# EAGLE schematic control_unit (EAGLE 5.11)

## Sheet 1 of 4
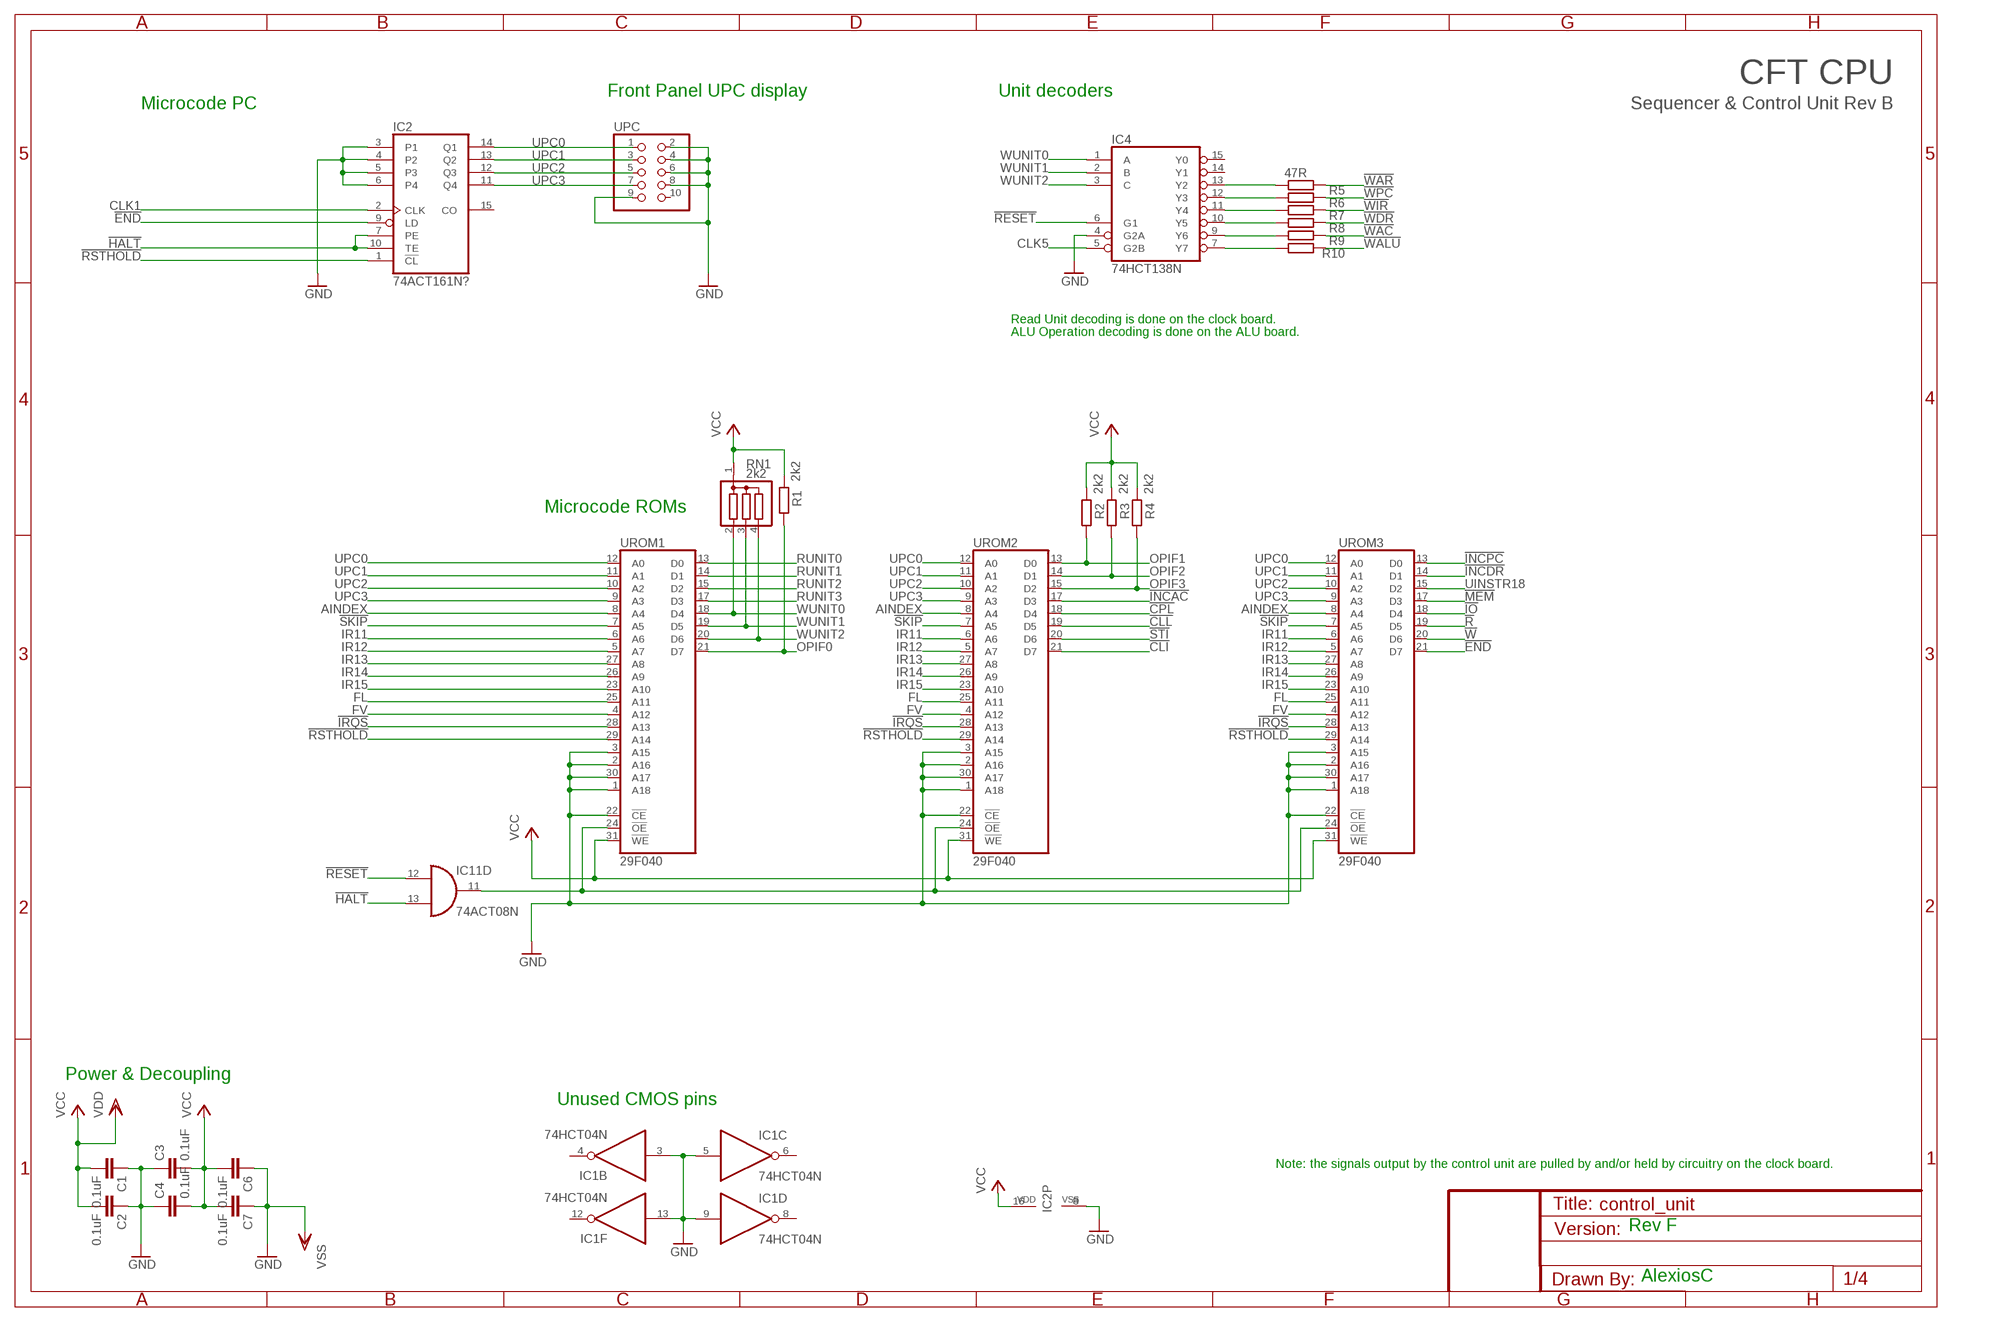
[diagram p0: schematic, sheet 1]

### Parts
C1  0.1uF  C-EU025-025X050  [C025-025X050]
C2  0.1uF  C-EU025-025X050  [C025-025X050]
C3  0.1uF  C-EU025-025X050  [C025-025X050]
C4  0.1uF  C-EU025-025X050  [C025-025X050]
C6  0.1uF  C-EU025-025X050  [C025-025X050]
C7  0.1uF  C-EU025-025X050  [C025-025X050]
IC1  74HCT04N  [DIL14]
IC2  74ACT161N?  4161P  [DIL16]
IC4  74HCT138N  [DIL16]
IC11  74ACT08N  [DIL14]
R1  2k2  R-EU_0207/7  [0207/7]
R2  2k2  R-EU_0207/7  [0207/7]
R3  2k2  R-EU_0207/7  [0207/7]
R4  2k2  R-EU_0207/7  [0207/7]
R5  47R  R-EU_0207/2V  [0207/2V]
R6  47R  R-EU_0207/2V  [0207/2V]
R7  47R  R-EU_0207/2V  [0207/2V]
R8  47R  R-EU_0207/2V  [0207/2V]
R9  47R  R-EU_0207/2V  [0207/2V]
R10  47R  R-EU_0207/2V  [0207/2V]
RN1  2k2  G03R  [SIL4]
UPC  PINHD-2X5/90  [2X05/90]
UROM1  29F040  29F040DIP32  [DIL32]
UROM2  29F040  29F040DIP32  [DIL32]
UROM3  29F040  29F040DIP32  [DIL32]

### Nets
!CLI: UROM2.21(D7) ; also sheet 3
!CLL: UROM2.19(D5) ; also sheet 3
!CPL: UROM2.18(D4) ; also sheet 3
!END: IC2.9(LD) UROM3.21(D7) ; also sheet 3
!HALT: IC2.7(PE) IC2.10(TE) IC11.13(D:I1) ; also sheet 3
!INCAC: UROM2.17(D3) ; also sheet 3
!INCDR: UROM3.14(D1) ; also sheet 3
!INCPC: UROM3.13(D0) ; also sheet 3
!IO: UROM3.18(D4) ; also sheet 3
!IRQS: UROM1.28(A13) UROM2.28(A13) UROM3.28(A13) ; also sheet 3,4
!MEM: UROM3.17(D3) ; also sheet 3
!R: UROM3.19(D5) ; also sheet 3
!RESET: IC4.6(G1) IC11.12(D:I0) ; also sheet 2,3
!RSTHOLD: IC2.1(!CL) UROM1.29(A14) UROM2.29(A14) UROM3.29(A14) ; also sheet 2,3,4
!SKIP: UROM1.7(A5) UROM2.7(A5) UROM3.7(A5) ; also sheet 2,3,4
!STI: UROM2.20(D6) ; also sheet 3
!W: UROM3.20(D6) ; also sheet 3
!WAC: R9.2 ; also sheet 3
!WALU: R10.2 ; also sheet 3
!WAR: R5.2 ; also sheet 3
!WDR: R8.2 ; also sheet 3
!WIR: R7.2 ; also sheet 2,3
!WPC: R6.2 ; also sheet 3
AINDEX: UROM1.8(A4) UROM2.8(A4) UROM3.8(A4) ; also sheet 3,4
CLK1: IC2.2(CLK) ; also sheet 2,3
CLK5: IC4.5(G2B) ; also sheet 3
FL: UROM1.25(A11) UROM2.25(A11) UROM3.25(A11) ; also sheet 2,3,4
FV: UROM1.4(A12) UROM2.4(A12) UROM3.4(A12) ; also sheet 2,3,4
GND [Power]: C1.1 C2.1 C3.1 C4.1 C6.1 C7.1 IC1.3(B:I) IC1.5(C:I) IC1.9(D:I) IC1.13(F:I) IC2.3(P1) IC2.4(P2) IC2.5(P3) IC2.6(P4) IC2.8(VSS) IC4.4(G2A) UPC.2 UPC.4 UPC.6 UPC.8 UPC.9 UROM1.1(A18) UROM1.2(A16) UROM1.3(A15) UROM1.22(!CE) UROM1.30(A17) UROM2.1(A18) UROM2.2(A16) UROM2.3(A15) UROM2.22(!CE) UROM2.30(A17) UROM3.1(A18) UROM3.2(A16) UROM3.3(A15) UROM3.22(!CE) UROM3.30(A17) ; supply symbol labelled VSS ; also sheet 2,3,4
IR11: UROM1.6(A6) UROM2.6(A6) UROM3.6(A6) ; also sheet 2,4
IR12: UROM1.5(A7) UROM2.5(A7) UROM3.5(A7) ; also sheet 2,4
IR13: UROM1.27(A8) UROM2.27(A8) UROM3.27(A8) ; also sheet 2,4
IR14: UROM1.26(A9) UROM2.26(A9) UROM3.26(A9) ; also sheet 2,4
IR15: UROM1.23(A10) UROM2.23(A10) UROM3.23(A10) ; also sheet 2,4
N$1: IC11.11(D:O) UROM1.24(!OE) UROM2.24(!OE) UROM3.24(!OE)
N$7: IC4.13(Y2) R5.1
N$8: IC4.12(Y3) R6.1
N$9: IC4.11(Y4) R7.1
N$10: IC4.10(Y5) R8.1
N$11: IC4.9(Y6) R9.1
N$12: IC4.7(Y7) R10.1
OPIF0: R1.1 UROM1.21(D7) ; also sheet 2
OPIF1: R2.1 UROM2.13(D0) ; also sheet 2
OPIF2: R3.1 UROM2.14(D1) ; also sheet 2
OPIF3: R4.1 UROM2.15(D2) ; also sheet 2
RUNIT0: UROM1.13(D0) ; also sheet 3
RUNIT1: UROM1.14(D1) ; also sheet 3
RUNIT2: UROM1.15(D2) ; also sheet 3
RUNIT3: UROM1.17(D3) ; also sheet 3
UINSTR18: UROM3.15(D2) ; also sheet 3
UPC0: IC2.14(Q1) UPC.1 UROM1.12(A0) UROM2.12(A0) UROM3.12(A0) ; also sheet 4
UPC1: IC2.13(Q2) UPC.3 UROM1.11(A1) UROM2.11(A1) UROM3.11(A1) ; also sheet 4
UPC2: IC2.12(Q3) UPC.5 UROM1.10(A2) UROM2.10(A2) UROM3.10(A2) ; also sheet 4
UPC3: IC2.11(Q4) UPC.7 UROM1.9(A3) UROM2.9(A3) UROM3.9(A3) ; also sheet 4
VCC [Power]: C1.2 C2.2 C3.2 C4.2 C6.2 C7.2 IC2.16(VDD) R1.2 R2.2 R3.2 R4.2 RN1.1 UROM1.31(!WE) UROM2.31(!WE) UROM3.31(!WE) ; supply symbol labelled VDD ; also sheet 2,3,4
WUNIT0: IC4.1(A) RN1.2 UROM1.18(D4)
WUNIT1: IC4.2(B) RN1.3 UROM1.19(D5)
WUNIT2: IC4.3(C) RN1.4 UROM1.20(D6)
Unconnected: IC1.1(A:I) IC1.2(A:O) IC1.4(B:O) IC1.6(C:O) IC1.8(D:O) IC1.12(F:O) IC2.15(CO) IC4.14(Y1) IC4.15(Y0) UPC.10

### Notes on the sheet
- CFT CPU
- Front Panel UPC display | Unit decoders
- Microcode PC | Sequencer & Control Unit Rev B
- Read Unit decoding is done on the clock board.
- ALU Operation decoding is done on the ALU board.
- Microcode ROMs
- Power & Decoupling
- Unused CMOS pins
- Note: the signals output by the control unit are pulled by and/or held by circuitry on the clock board.
- Rev F
- AlexiosC

## Sheet 2 of 4
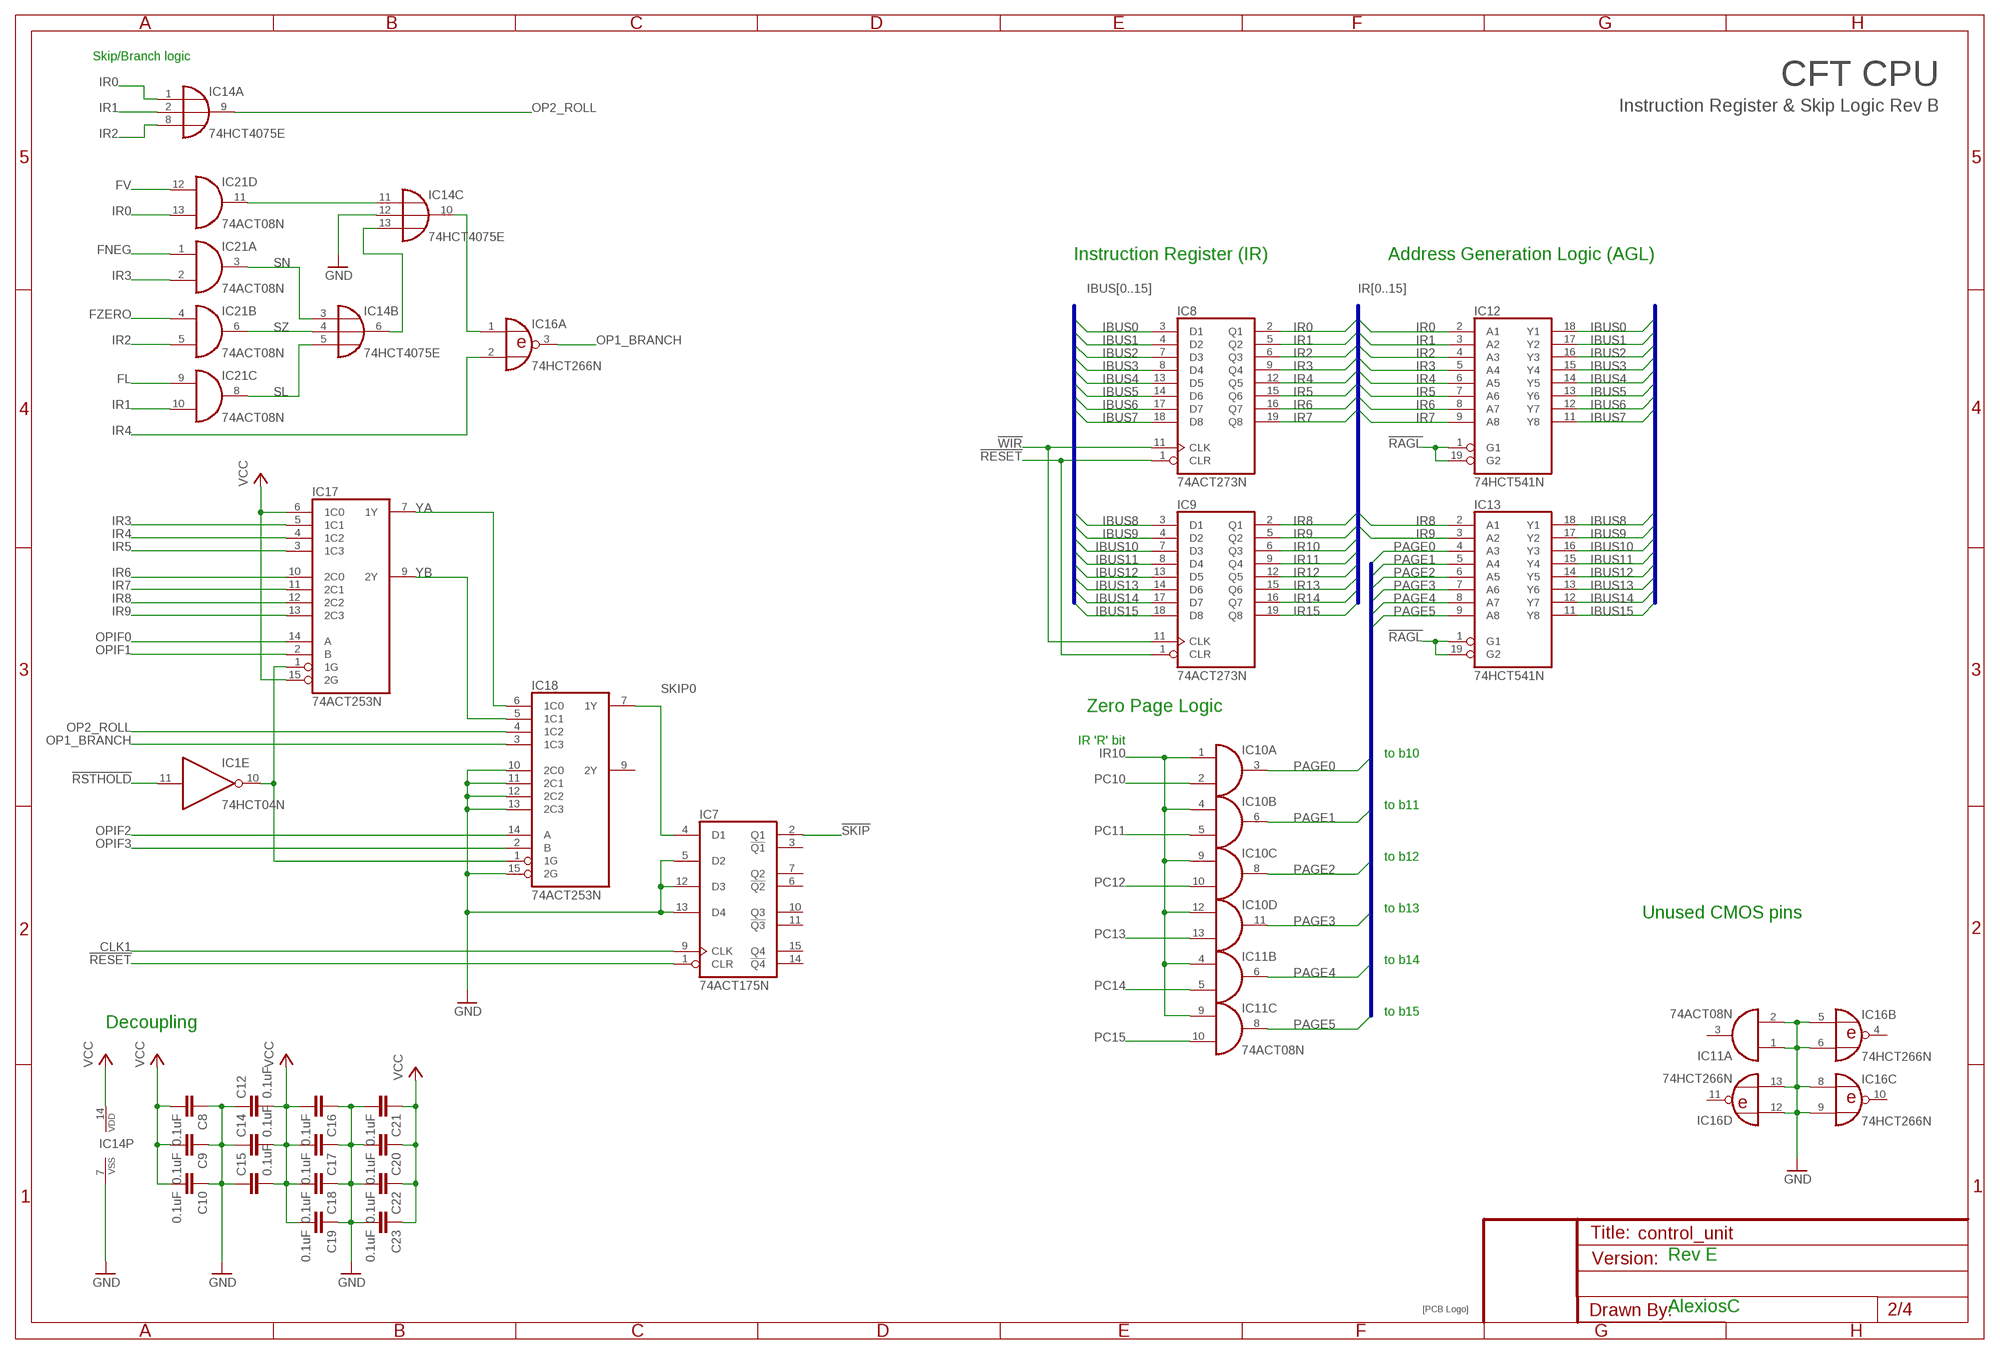
[diagram p1: schematic, sheet 2]

### Parts
C8  0.1uF  C-EU025-025X050  [C025-025X050]
C9  0.1uF  C-EU025-025X050  [C025-025X050]
C10  0.1uF  C-EU025-025X050  [C025-025X050]
C12  0.1uF  C-EU025-025X050  [C025-025X050]
C14  0.1uF  C-EU025-025X050  [C025-025X050]
C15  0.1uF  C-EU025-025X050  [C025-025X050]
C16  0.1uF  C-EU025-025X050  [C025-025X050]
C17  0.1uF  C-EU025-025X050  [C025-025X050]
C18  0.1uF  C-EU025-025X050  [C025-025X050]
C19  0.1uF  C-EU025-025X050  [C025-025X050]
C20  0.1uF  C-EU025-025X050  [C025-025X050]
C21  0.1uF  C-EU025-025X050  [C025-025X050]
C22  0.1uF  C-EU025-025X050  [C025-025X050]
C23  0.1uF  C-EU025-025X050  [C025-025X050]
IC7  74ACT175N  [DIL16]
IC8  74ACT273N  [DIL20]
IC9  74ACT273N  [DIL20]
IC10  74ACT08N  [DIL14]
IC12  74HCT541N  [DIL20]
IC13  74HCT541N  [DIL20]
IC14  74HCT4075E  4075N  [DIL14]
IC16  74HCT266N  74HC266N  [DIL14]
IC17  74ACT253N  [DIL16]
IC18  74ACT253N  [DIL16]
IC21  74ACT08N  [DIL14]
U$3  SIGNATURESILK  [SIGNATURE]

### Nets
!RAGL: IC12.1(G1) IC12.19(G2) IC13.1(G1) IC13.19(G2) ; also sheet 3
!RESET: IC7.1(CLR) IC8.1(CLR) IC9.1(CLR) ; also sheet 1,3
!RSTHOLD: IC1.11(E:I) ; also sheet 1,3,4
!SKIP: IC7.2(Q1) ; also sheet 1,3,4
!WIR: IC8.11(CLK) IC9.11(CLK) ; also sheet 1,3
CLK1: IC7.9(CLK) ; also sheet 1,3
FL: IC21.9(C:I0) ; also sheet 1,3,4
FNEG: IC21.1(A:I0) ; also sheet 3
FV: IC21.12(D:I0) ; also sheet 1,3,4
FZERO: IC21.4(B:I0) ; also sheet 3
GND [Power]: C8.1 C9.1 C10.1 C12.1 C14.1 C15.1 C16.1 C17.1 C18.1 C19.1 C20.2 C21.2 C22.2 C23.2 IC7.5(D2) IC7.12(D3) IC7.13(D4) IC11.1(A:I0) IC11.2(A:I1) IC14.7(P:VSS) IC14.12(C:I1) IC16.5(B:I0) IC16.6(B:I1) IC16.8(C:I0) IC16.9(C:I1) IC16.12(D:I0) IC16.13(D:I1) IC18.10(2C0) IC18.11(2C1) IC18.12(2C2) IC18.13(2C3) IC18.15(2G) ; also sheet 1,3,4
IBUS0: IC8.3(D1) IC12.18(Y1) ; also sheet 3
IBUS1: IC8.4(D2) IC12.17(Y2) ; also sheet 3
IBUS2: IC8.7(D3) IC12.16(Y3) ; also sheet 3
IBUS3: IC8.8(D4) IC12.15(Y4) ; also sheet 3
IBUS4: IC8.13(D5) IC12.14(Y5) ; also sheet 3
IBUS5: IC8.14(D6) IC12.13(Y6) ; also sheet 3
IBUS6: IC8.17(D7) IC12.12(Y7) ; also sheet 3
IBUS7: IC8.18(D8) IC12.11(Y8) ; also sheet 3
IBUS8: IC9.3(D1) IC13.18(Y1) ; also sheet 3
IBUS9: IC9.4(D2) IC13.17(Y2) ; also sheet 3
IBUS10: IC9.7(D3) IC13.16(Y3) ; also sheet 3
IBUS11: IC9.8(D4) IC13.15(Y4) ; also sheet 3
IBUS12: IC9.13(D5) IC13.14(Y5) ; also sheet 3
IBUS13: IC9.14(D6) IC13.13(Y6) ; also sheet 3
IBUS14: IC9.17(D7) IC13.12(Y7) ; also sheet 3
IBUS15: IC9.18(D8) IC13.11(Y8) ; also sheet 3
IR0: IC8.2(Q1) IC12.2(A1) IC14.1(A:I0) IC21.13(D:I1) ; also sheet 3
IR1: IC8.5(Q2) IC12.3(A2) IC14.2(A:I1) IC21.10(C:I1) ; also sheet 3
IR2: IC8.6(Q3) IC12.4(A3) IC14.8(A:I2) IC21.5(B:I1) ; also sheet 3
IR3: IC8.9(Q4) IC12.5(A4) IC17.5(1C1) IC21.2(A:I1)
IR4: IC8.12(Q5) IC12.6(A5) IC16.2(A:I1) IC17.4(1C2)
IR5: IC8.15(Q6) IC12.7(A6) IC17.3(1C3)
IR6: IC8.16(Q7) IC12.8(A7) IC17.10(2C0)
IR7: IC8.19(Q8) IC12.9(A8) IC17.11(2C1)
IR8: IC9.2(Q1) IC13.2(A1) IC17.12(2C2)
IR9: IC9.5(Q2) IC13.3(A2) IC17.13(2C3)
IR10: IC9.6(Q3) IC10.1(A:I0) IC10.4(B:I0) IC10.9(C:I0) IC10.12(D:I0) IC11.4(B:I0) IC11.9(C:I0)
IR11: IC9.9(Q4) ; also sheet 1,4
IR12: IC9.12(Q5) ; also sheet 1,4
IR13: IC9.15(Q6) ; also sheet 1,4
IR14: IC9.16(Q7) ; also sheet 1,4
IR15: IC9.19(Q8) ; also sheet 1,4
N$2: IC14.10(C:O) IC16.1(A:I0)
N$13: IC14.6(B:O) IC14.13(C:I2)
N$14: IC14.11(C:I0) IC21.11(D:O)
OP1_BRANCH: IC16.3(A:O) IC18.3(1C3)
OP2_ROLL: IC14.9(A:O) IC18.4(1C2)
OPIF0: IC17.14(A) ; also sheet 1
OPIF1: IC17.2(B) ; also sheet 1
OPIF2: IC18.14(A) ; also sheet 1
OPIF3: IC18.2(B) ; also sheet 1
PAGE0: IC10.3(A:O) IC13.4(A3)
PAGE1: IC10.6(B:O) IC13.5(A4)
PAGE2: IC10.8(C:O) IC13.6(A5)
PAGE3: IC10.11(D:O) IC13.7(A6)
PAGE4: IC11.6(B:O) IC13.8(A7)
PAGE5: IC11.8(C:O) IC13.9(A8)
PC10: IC10.2(A:I1) ; also sheet 3
PC11: IC10.5(B:I1) ; also sheet 3
PC12: IC10.10(C:I1) ; also sheet 3
PC13: IC10.13(D:I1) ; also sheet 3
PC14: IC11.5(B:I1) ; also sheet 3
PC15: IC11.10(C:I1) ; also sheet 3
RSTHOLD: IC1.10(E:O) IC17.1(1G) IC18.1(1G)
SKIP0: IC7.4(D1) IC18.7(1Y)
SL: IC14.5(B:I2) IC21.8(C:O)
SN: IC14.3(B:I0) IC21.3(A:O)
SZ: IC14.4(B:I1) IC21.6(B:O)
VCC [Power]: C8.2 C9.2 C10.2 C12.2 C14.2 C15.2 C16.2 C17.2 C18.2 C19.2 C20.1 C21.1 C22.1 C23.1 IC14.14(P:VDD) IC17.6(1C0) IC17.15(2G) ; also sheet 1,3,4
YA: IC17.7(1Y) IC18.6(1C0)
YB: IC17.9(2Y) IC18.5(1C1)
Unconnected: IC7.3(!Q1) IC7.6(!Q2) IC7.7(Q2) IC7.10(Q3) IC7.11(!Q3) IC7.14(!Q4) IC7.15(Q4) IC11.3(A:O) IC16.4(B:O) IC16.10(C:O) IC16.11(D:O) IC18.9(2Y)

### Buses
IBUS[0..15]
IR[0..15]
PAGE[0..5]

### Notes on the sheet
- Skip/Branch logic
- CFT CPU
- Instruction Register & Skip Logic Rev B
- Instruction Register (IR) | Address Generation Logic (AGL)
- Zero Page Logic
- IR 'R' bit
- to b10
- to b11
- to b12
- to b13
- Unused CMOS pins
- to b14
- to b15
- Decoupling
- Rev E
- AlexiosC

## Sheet 3 of 4
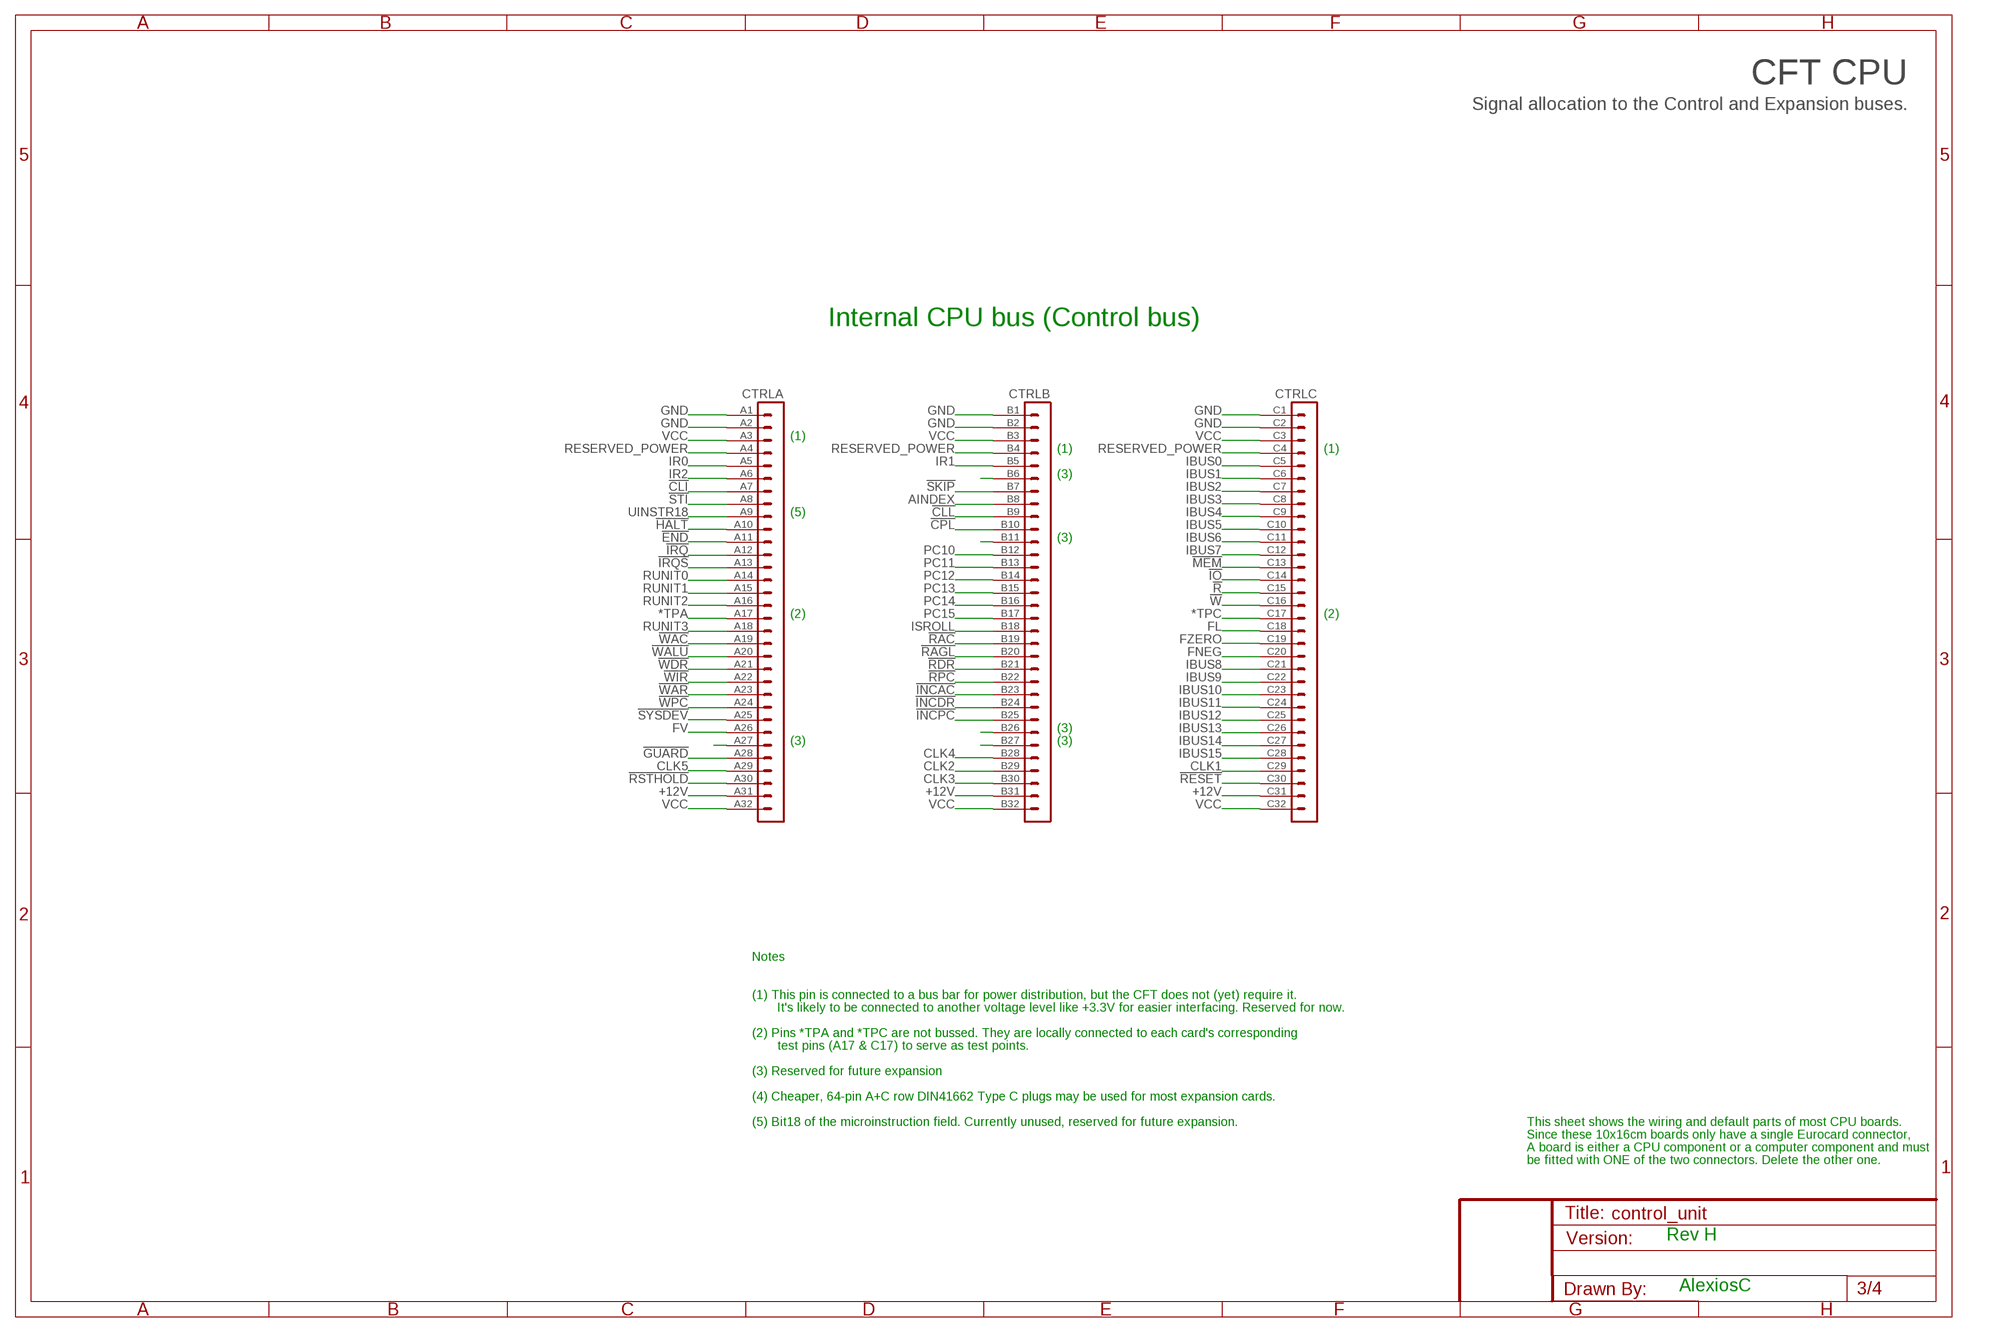
[diagram p2: schematic, sheet 3]

### Parts
CTRL  VG96-3B  [VG96B]

### Nets
!CLI: CTRL.A7 ; also sheet 1
!CLL: CTRL.B9 ; also sheet 1
!CPL: CTRL.B10 ; also sheet 1
!END: CTRL.A11 ; also sheet 1
!GUARD: CTRL.A28
!HALT: CTRL.A10 ; also sheet 1
!INCAC: CTRL.B23 ; also sheet 1
!INCDR: CTRL.B24 ; also sheet 1
!INCPC: CTRL.B25 ; also sheet 1
!IO: CTRL.C14 ; also sheet 1
!IRQ: CTRL.A12
!IRQS: CTRL.A13 ; also sheet 1,4
!MEM: CTRL.C13 ; also sheet 1
!R: CTRL.C15 ; also sheet 1
!RAC: CTRL.B19
!RAGL: CTRL.B20 ; also sheet 2
!RDR: CTRL.B21
!RESET: CTRL.C30 ; also sheet 1,2
!RPC: CTRL.B22
!RSTHOLD: CTRL.A30 ; also sheet 1,2,4
!SKIP: CTRL.B7 ; also sheet 1,2,4
!STI: CTRL.A8 ; also sheet 1
!SYSDEV: CTRL.A25
!W: CTRL.C16 ; also sheet 1
!WAC: CTRL.A19 ; also sheet 1
!WALU: CTRL.A20 ; also sheet 1
!WAR: CTRL.A23 ; also sheet 1
!WDR: CTRL.A21 ; also sheet 1
!WIR: CTRL.A22 ; also sheet 1,2
!WPC: CTRL.A24 ; also sheet 1
*TPA: CTRL.A17
*TPC: CTRL.C17
+12V [12V]: CTRL.A31 CTRL.B31 CTRL.C31
AINDEX: CTRL.B8 ; also sheet 1,4
CLK1: CTRL.C29 ; also sheet 1,2
CLK2: CTRL.B29
CLK3: CTRL.B30
CLK4: CTRL.B28
CLK5: CTRL.A29 ; also sheet 1
FL: CTRL.C18 ; also sheet 1,2,4
FNEG: CTRL.C20 ; also sheet 2
FV: CTRL.A26 ; also sheet 1,2,4
FZERO: CTRL.C19 ; also sheet 2
GND [Power]: CTRL.A1 CTRL.A2 CTRL.B1 CTRL.B2 CTRL.C1 CTRL.C2 ; also sheet 1,2,4
IBUS0: CTRL.C5 ; also sheet 2
IBUS1: CTRL.C6 ; also sheet 2
IBUS2: CTRL.C7 ; also sheet 2
IBUS3: CTRL.C8 ; also sheet 2
IBUS4: CTRL.C9 ; also sheet 2
IBUS5: CTRL.C10 ; also sheet 2
IBUS6: CTRL.C11 ; also sheet 2
IBUS7: CTRL.C12 ; also sheet 2
IBUS8: CTRL.C21 ; also sheet 2
IBUS9: CTRL.C22 ; also sheet 2
IBUS10: CTRL.C23 ; also sheet 2
IBUS11: CTRL.C24 ; also sheet 2
IBUS12: CTRL.C25 ; also sheet 2
IBUS13: CTRL.C26 ; also sheet 2
IBUS14: CTRL.C27 ; also sheet 2
IBUS15: CTRL.C28 ; also sheet 2
IR0: CTRL.A5 ; also sheet 2
IR1: CTRL.B5 ; also sheet 2
IR2: CTRL.A6 ; also sheet 2
ISROLL: CTRL.B18
N$3: CTRL.B6
N$4: CTRL.A27
N$5: CTRL.B27
N$6: CTRL.B26
N$47: CTRL.B11
PC10: CTRL.B12 ; also sheet 2
PC11: CTRL.B13 ; also sheet 2
PC12: CTRL.B14 ; also sheet 2
PC13: CTRL.B15 ; also sheet 2
PC14: CTRL.B16 ; also sheet 2
PC15: CTRL.B17 ; also sheet 2
RESERVED_POWER: CTRL.A4 CTRL.B4 CTRL.C4
RUNIT0: CTRL.A14 ; also sheet 1
RUNIT1: CTRL.A15 ; also sheet 1
RUNIT2: CTRL.A16 ; also sheet 1
RUNIT3: CTRL.A18 ; also sheet 1
UINSTR18: CTRL.A9 ; also sheet 1
VCC [Power]: CTRL.A3 CTRL.A32 CTRL.B3 CTRL.B32 CTRL.C3 CTRL.C32 ; also sheet 1,2,4

### Notes on the sheet
- CFT CPU
- Signal allocation to the Control and Expansion buses.
- Internal CPU bus (Control bus)
- (1)
- (1) | (1)
- (3)
- (5)
- (3)
- (2) | (2)
- (3)
- (3) | (3)
- Notes
- (1) This pin is connected to a bus bar for power distribution, but the CFT does not (yet) require it.
- It's likely to be connected to another voltage level like +3.3V for easier interfacing. Reserved for now.
- (2) Pins *TPA and *TPC are not bussed. They are locally connected to each card's corresponding
- test pins (A17 & C17) to serve as test points.
- (3) Reserved for future expansion
- (4) Cheaper, 64-pin A+C row DIN41662 Type C plugs may be used for most expansion cards.
- (5) Bit18 of the microinstruction field. Currently unused, reserved for future expansion. | This sheet shows the wiring and default parts of most CPU boards.
- Since these 10x16cm boards only have a single Eurocard connector,
- A board is either a CPU component or a computer component and must
- be fitted with ONE of the two connectors. Delete the other one.
- Rev H
- AlexiosC

## Sheet 4 of 4
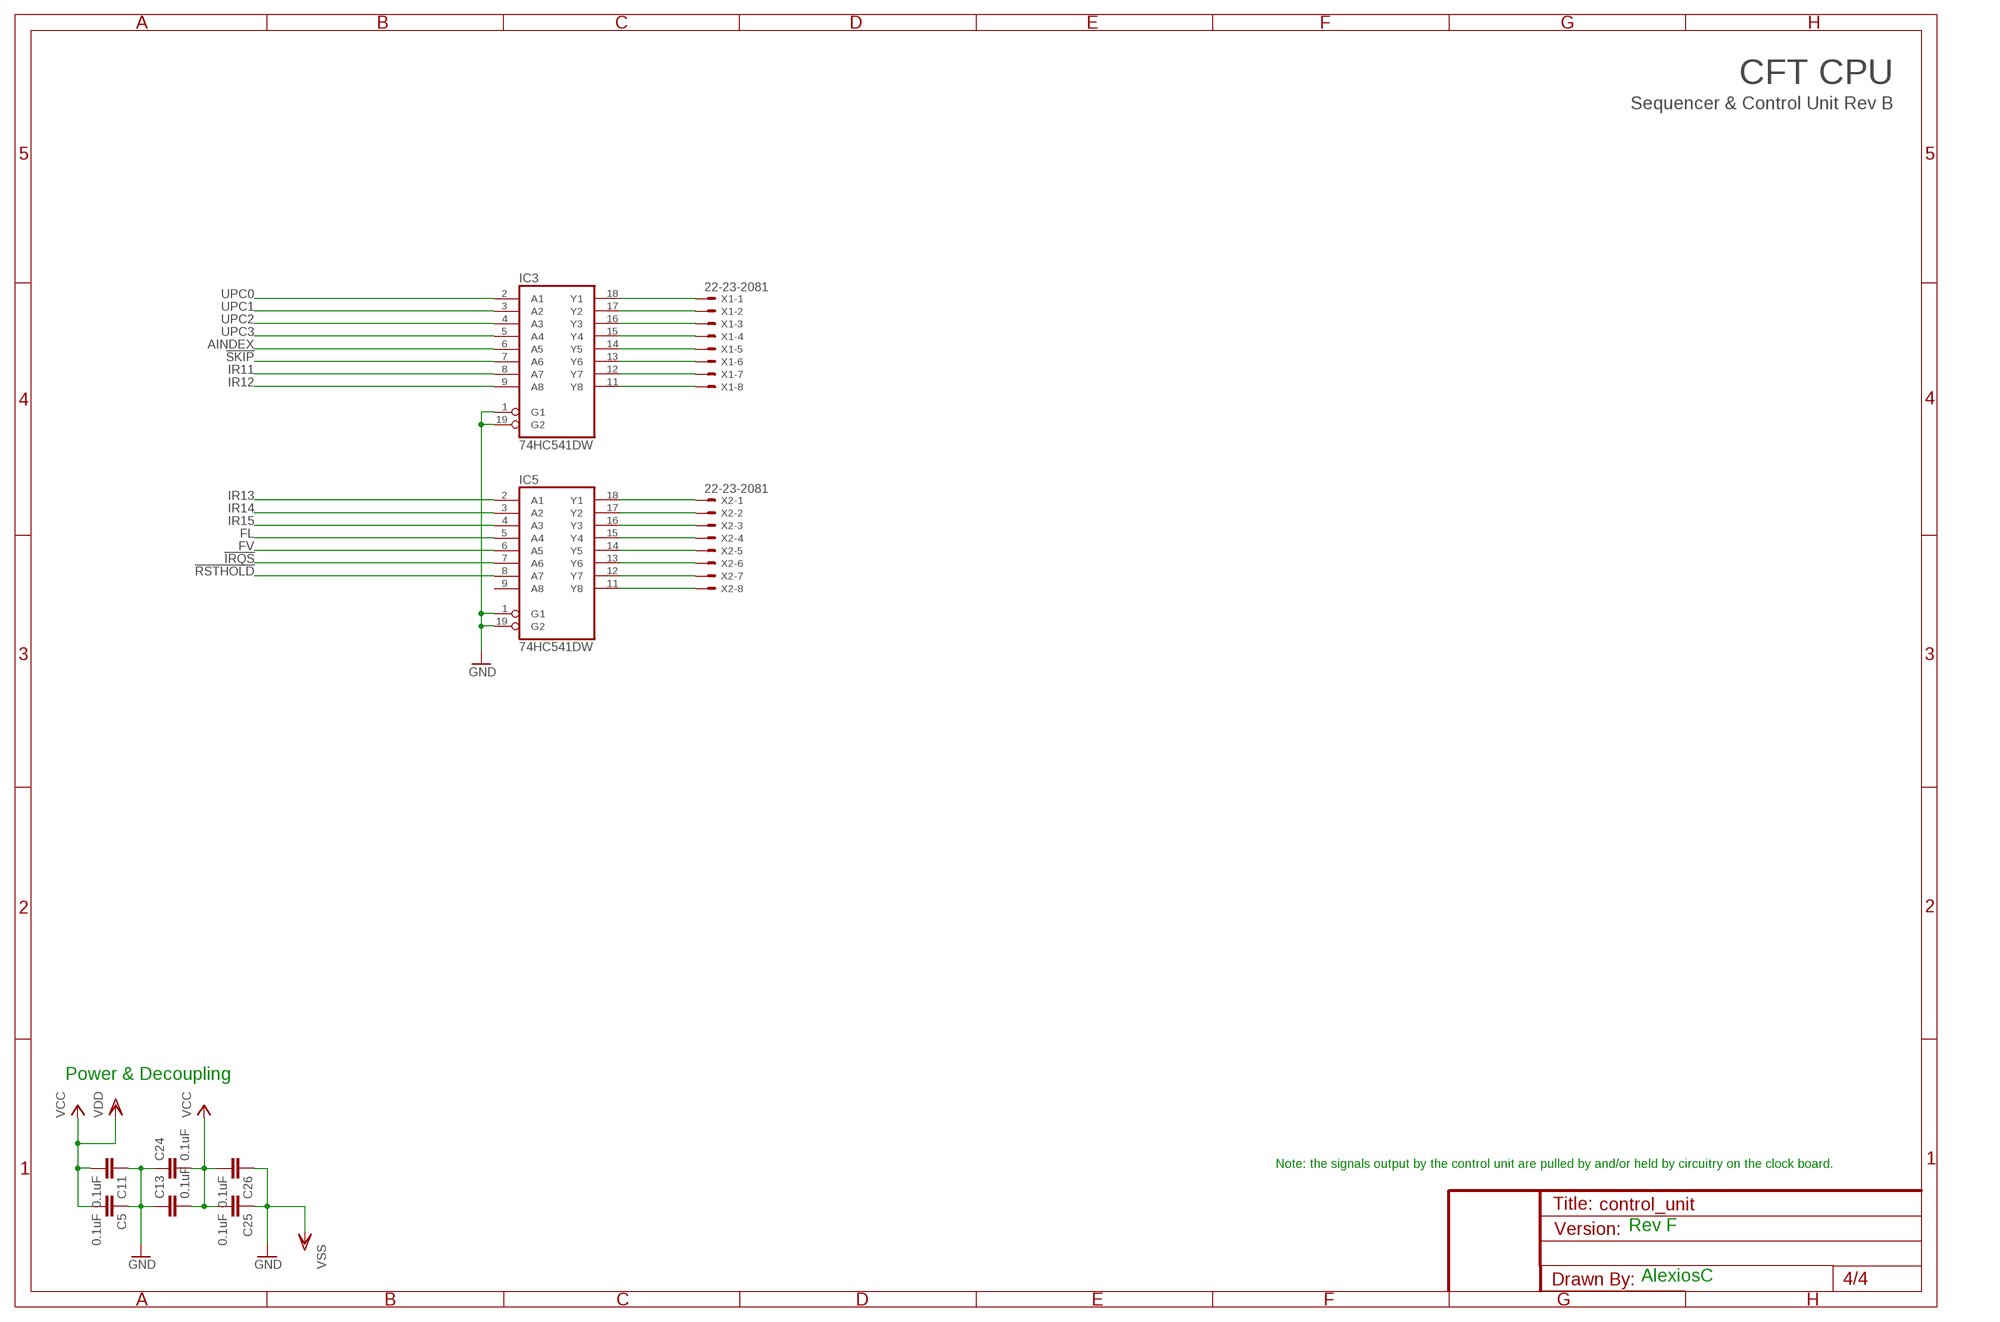
[diagram p3: schematic, sheet 4]

### Parts
C5  0.1uF  C-EU025-025X050  [C025-025X050]
C11  0.1uF  C-EU025-025X050  [C025-025X050]
C13  0.1uF  C-EU025-025X050  [C025-025X050]
C24  0.1uF  C-EU025-025X050  [C025-025X050]
C25  0.1uF  C-EU025-025X050  [C025-025X050]
C26  0.1uF  C-EU025-025X050  [C025-025X050]
IC3  74HC541DW  [SO20W]
IC5  74HC541DW  [SO20W]
X1  22-23-2081  [22-23-2081]
X2  22-23-2081  [22-23-2081]

### Nets
!IRQS: IC5.7(A6) ; also sheet 1,3
!RSTHOLD: IC5.8(A7) ; also sheet 1,2,3
!SKIP: IC3.7(A6) ; also sheet 1,2,3
AINDEX: IC3.6(A5) ; also sheet 1,3
FL: IC5.5(A4) ; also sheet 1,2,3
FV: IC5.6(A5) ; also sheet 1,2,3
GND [Power]: C5.1 C11.1 C13.1 C24.1 C25.1 C26.1 IC3.1(G1) IC3.19(G2) IC5.1(G1) IC5.19(G2) ; supply symbol labelled VSS ; also sheet 1,2,3
IR11: IC3.8(A7) ; also sheet 1,2
IR12: IC3.9(A8) ; also sheet 1,2
IR13: IC5.2(A1) ; also sheet 1,2
IR14: IC5.3(A2) ; also sheet 1,2
IR15: IC5.4(A3) ; also sheet 1,2
N$15: IC3.18(Y1) X1.1
N$16: IC3.17(Y2) X1.2
N$17: IC3.16(Y3) X1.3
N$18: IC3.15(Y4) X1.4
N$19: IC3.14(Y5) X1.5
N$20: IC3.13(Y6) X1.6
N$21: IC3.12(Y7) X1.7
N$22: IC3.11(Y8) X1.8
N$23: IC5.18(Y1) X2.1
N$24: IC5.17(Y2) X2.2
N$25: IC5.16(Y3) X2.3
N$26: IC5.15(Y4) X2.4
N$27: IC5.14(Y5) X2.5
N$28: IC5.13(Y6) X2.6
N$29: IC5.12(Y7) X2.7
N$30: IC5.11(Y8) X2.8
UPC0: IC3.2(A1) ; also sheet 1
UPC1: IC3.3(A2) ; also sheet 1
UPC2: IC3.4(A3) ; also sheet 1
UPC3: IC3.5(A4) ; also sheet 1
VCC [Power]: C5.2 C11.2 C13.2 C24.2 C25.2 C26.2 ; supply symbol labelled VDD ; also sheet 1,2,3
Unconnected: IC5.9(A8)

### Notes on the sheet
- CFT CPU
- Sequencer & Control Unit Rev B
- Power & Decoupling
- Note: the signals output by the control unit are pulled by and/or held by circuitry on the clock board.
- Rev F
- AlexiosC

## Power pins joined to a net without a drawn wire
GND: IC1.7(P:GND) IC3.10(GND) IC4.8(GND) IC5.10(GND) IC7.8(GND) IC8.10(GND) IC9.10(GND) IC10.7(P:GND) IC11.7(P:GND) IC12.10(GND) IC13.10(GND) IC16.7(P:GND) IC17.8(GND) IC18.8(GND) IC21.7(P:GND) UROM1.16(GND) UROM2.16(GND) UROM3.16(GND)
VCC: IC1.14(P:VCC) IC3.20(VCC) IC4.16(VCC) IC5.20(VCC) IC7.16(VCC) IC8.20(VCC) IC9.20(VCC) IC10.14(P:VCC) IC11.14(P:VCC) IC12.20(VCC) IC13.20(VCC) IC16.14(P:VCC) IC17.16(VCC) IC18.16(VCC) IC21.14(P:VCC) UROM1.32(VCC) UROM2.32(VCC) UROM3.32(VCC)

## Library data of the parts
C1-C26 = rcl:C-EU: CAPACITOR, European symbol
CTRL = 19inch:VG96-3: PCB EUROCARD, 96-pin type C/ABC, 2.54 mm
IC1 = 74xx-eu:74*04: Hex INVERTER
IC2 = 41xx:4161: 41xx DEVICE
IC3 IC5 IC12 IC13 = 74xx-eu:74*541: Octal BUFFER and LINE DRIVER, 3-state
IC4 = 74xx-eu:74*138: 3-line to 8-line DECODER/DEMULTIPLEXER
IC7 = 74xx-eu:74*175: Qadruple D type FLIP FLOP, clear
IC8 IC9 = 74xx-eu:74*273: Octal D type FLIP FLOP, clear
IC10 IC11 IC21 = 74xx-eu:74*08: Quad 2-input AND gate
IC14 = 40xx:4075: Triple 3-input OR
IC16 = 74xx-eu:74*266: Quadruple EXCLUSIVE-NOR (XNOR), open-collector
IC17 IC18 = 74xx-eu:74*253: Dual 4-to 1 line data SELECTOR/MULTIPLEXER, 3-state
R1-R10 = resistor:R-EU_: RESISTOR, European symbol
RN1 = resistor-sil:G03R: SIL RESISTOR; OC_FARNELL: unknown; OC_NEWARK: unknown
U$3 = alexios:SIGNATURE: Soup signature
UPC = pinhead:PINHD-2X5: PIN HEADER
UROM1-UROM3 = alexios:29F040: 4-mbit (512x8) Flash memory in a PLCC32 package (with socket). AM29F040 is an example of this.
X1 X2 = con-molex:22-23-2081: .100" (2.54mm) Center Header - 8 Pin; MF: MOLEX; MPN: 22-23-2081; OC_FARNELL: 1756826; OC_NEWARK: 01C7592

## Net classes
0 default: width 0.305 mm, clearance 0.254 mm
1 Power: width 0.635 mm, clearance 0.254 mm
2 12V: width 0.635 mm, clearance 0.635 mm